# EAGLE schematic dualHbridge (EAGLE 7.1.0)
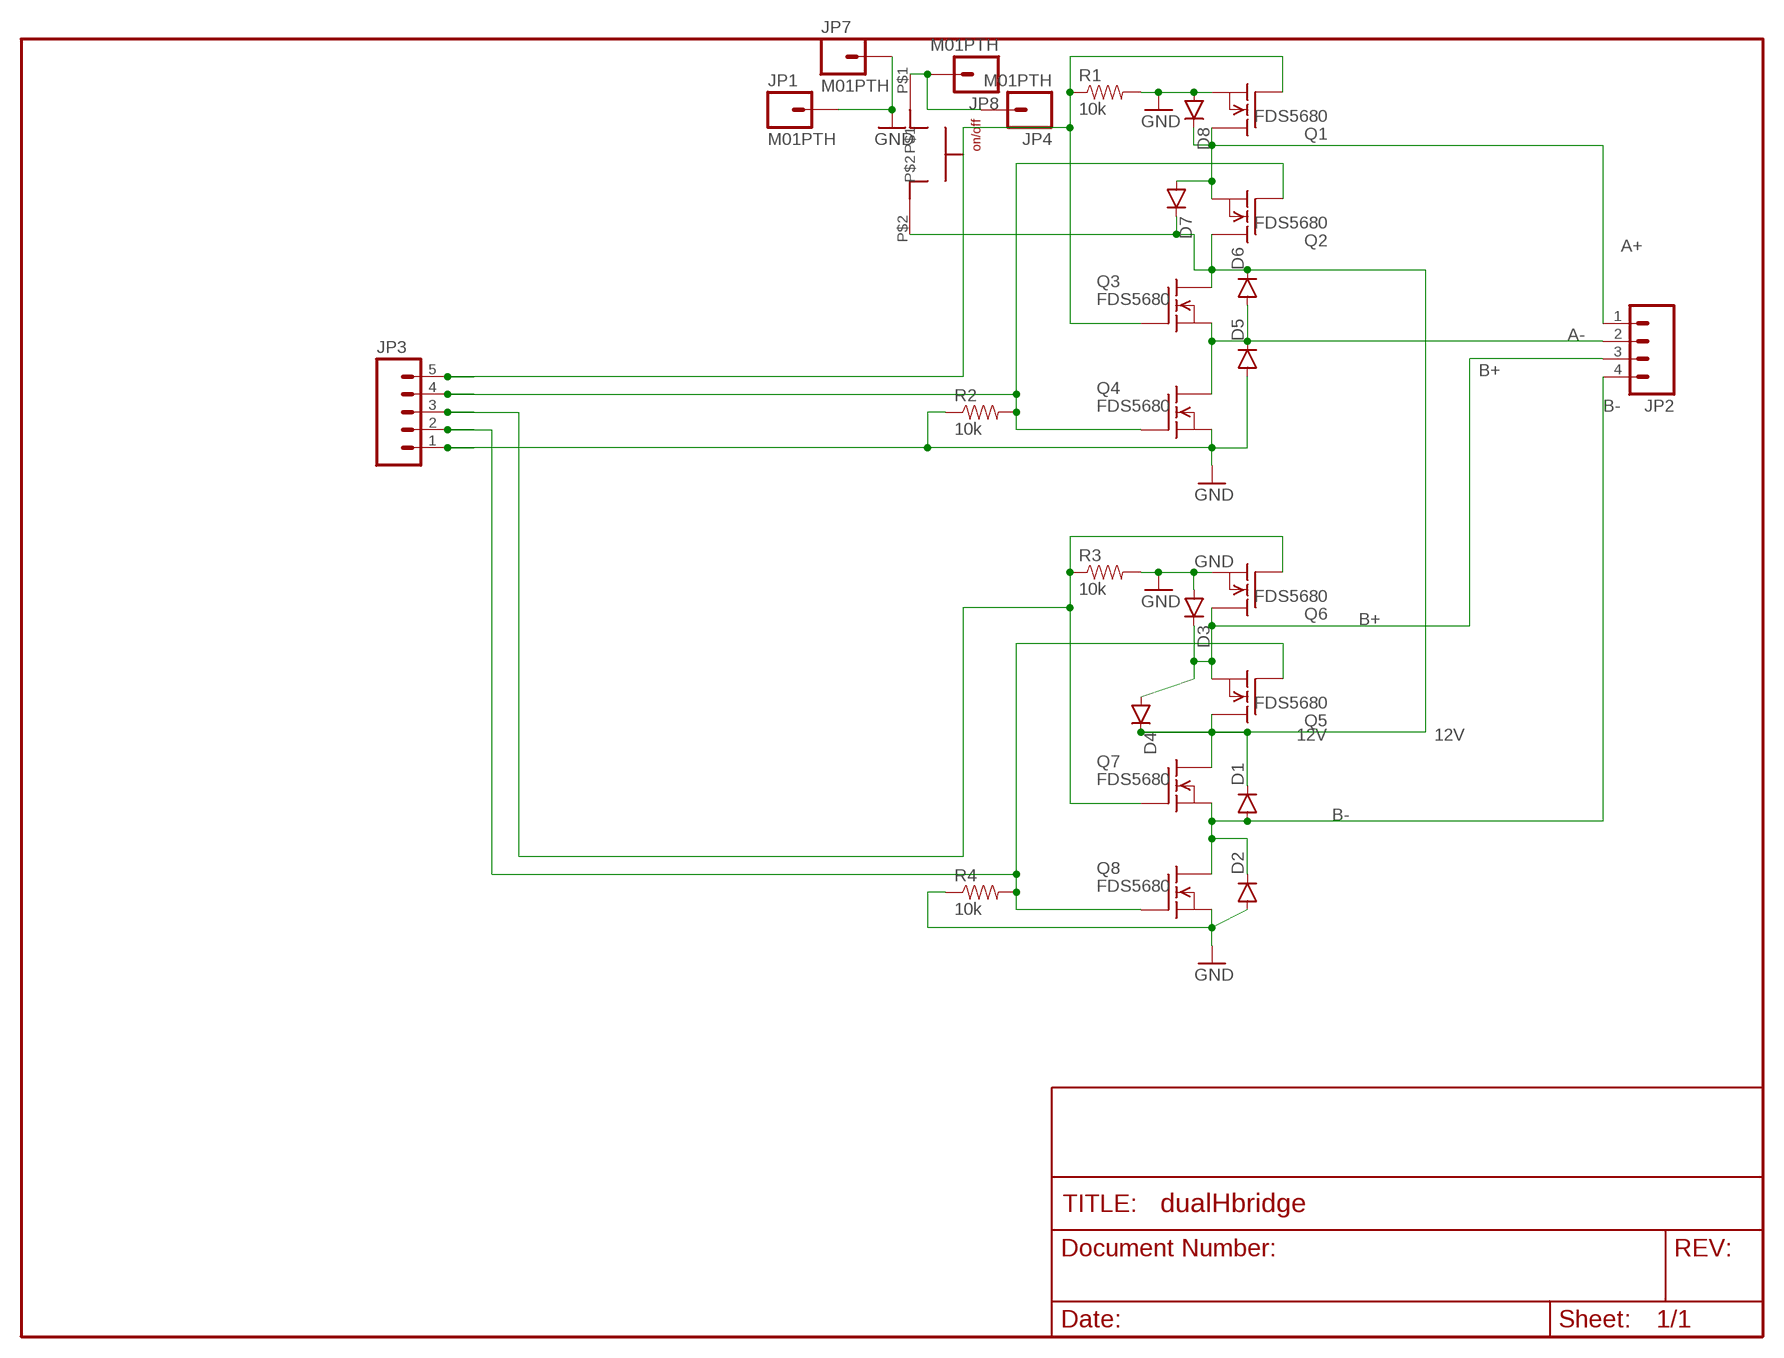
[diagram p0: schematic, sheet 1]

## Parts
D1  DIODEKIT2  [DIODE-1N4001-KIT]
D2  DIODEKIT2  [DIODE-1N4001-KIT]
D3  DIODEKIT2  [DIODE-1N4001-KIT]
D4  DIODEKIT2  [DIODE-1N4001-KIT]
D5  DIODEKIT2  [DIODE-1N4001-KIT]
D6  DIODEKIT2  [DIODE-1N4001-KIT]
D7  DIODEKIT2  [DIODE-1N4001-KIT]
D8  DIODEKIT2  [DIODE-1N4001-KIT]
JP1  M01PTH  [1X01]
JP2  M04LONGPADS  [1X04_LONGPADS]
JP3  M05PTH  [1X05]
JP4  M01PTH  [1X01]
JP7  M01PTH  [1X01]
JP8  M01PTH  [1X01]
Q1  FDS5680  [SO-8]
Q2  FDS5680  [SO-8]
Q3  FDS5680  [SO-8]
Q4  FDS5680  [SO-8]
Q5  FDS5680  [SO-8]
Q6  FDS5680  [SO-8]
Q7  FDS5680  [SO-8]
Q8  FDS5680  [SO-8]
R1  10k  RESISTOR0603-RES  [0603-RES]
R2  10k  RESISTOR0603-RES  [0603-RES]
R3  10k  RESISTOR0603-RES  [0603-RES]
R4  10k  RESISTOR0603-RES  [0603-RES]
U$5  CW182-ND  [CW182-ND]

## Nets
12V: D1.C D4.C D6.C D7.C Q2.5(D) Q2.6(D) Q2.7(D) Q2.8(D) Q3.5(D) Q3.6(D) Q3.7(D) Q3.8(D) Q5.5(D) Q5.6(D) Q5.7(D) Q5.8(D) Q7.5(D) Q7.6(D) Q7.7(D) Q7.8(D) U$5.P$2
A+: D7.A D8.C JP2.1 Q1.5(D) Q1.6(D) Q1.7(D) Q1.8(D) Q2.1(S) Q2.2(S) Q2.3(S)
A-: D5.C D6.A JP2.2 Q3.1(S) Q3.2(S) Q3.3(S) Q4.5(D) Q4.6(D) Q4.7(D) Q4.8(D)
B+: D3.C D4.A JP2.3 Q5.1(S) Q5.2(S) Q5.3(S) Q6.5(D) Q6.6(D) Q6.7(D) Q6.8(D)
B-: D1.A D2.C JP2.4 Q7.1(S) Q7.2(S) Q7.3(S) Q8.5(D) Q8.6(D) Q8.7(D) Q8.8(D)
GND: D2.A D3.A D5.A D8.A JP1.1 JP3.1 JP7.1 Q1.1(S) Q1.2(S) Q1.3(S) Q4.1(S) Q4.2(S) Q4.3(S) Q6.1(S) Q6.2(S) Q6.3(S) Q8.1(S) Q8.2(S) Q8.3(S) R1.2 R2.1 R3.2 R4.1
N$6: JP3.5 Q1.4(G) Q3.4(G) R1.1
N$7: JP3.4 Q2.4(G) Q4.4(G) R2.2
N$13: JP3.3 Q6.4(G) Q7.4(G) R3.1
N$14: JP3.2 Q5.4(G) Q8.4(G) R4.2
N$15: JP4.1 JP8.1 U$5.P$1

## Library data of the parts
D1-D8 = SparkFun-DiscreteSemi:DIODE: Diode These are standard reverse protection diodes and small signal diodes. SMA package can handle up to about 1A. SOD-323 can handle about 200mA. What the SOD-323 package when ordering, there are some mfgs out there that are 5-pin packages.
JP1 JP4 JP7 JP8 = SparkFun-Connectors:M01: Header 1 Standard 1-pin 0.1" header. Use with straight break away headers (SKU : PRT-00116), right angle break away headers (PRT-00553), swiss pins (PRT-00743), machine pins (PRT-00117), and female headers (PRT-00115).
JP2 = SparkFun-Connectors:M04: Header 4 Standard 4-pin 0.1" header. Use with straight break away headers (SKU : PRT-00116), right angle break away headers (PRT-00553), swiss pins (PRT-00743), machine pins (PRT-00117), and female headers (PRT-00115). Molex polarized connector foot print use with SKU : PRT-08231 with associated crimp pins and housings. 1MM SMD Version SKU: PRT-10208
JP3 = SparkFun-Connectors:M05: Header 5 Standard 5-pin 0.1" header. Use with straight break away headers (SKU : PRT-00116), right angle break away headers (PRT-00553), swiss pins (PRT-00743), machine pins (PRT-00117), and female headers (PRT-00115). Molex polarized connector foot print use with SKU : PRT-08230 with associated crimp pins and housings.
Q1-Q8 = transistor-fet:FDS5680: 60V N-Channel PowerTrench TM MOSFET FAIRCHILD FDS5680.pdf
R1-R4 = SparkFun-Passives:RESISTOR: Resistor Basic schematic elements and footprints for 0603, 1206, and PTH resistors.
U$5 = spietz-library:CW182-ND

## Net classes
0 default: width 0.203 mm
1 vcc: width 0.254 mm